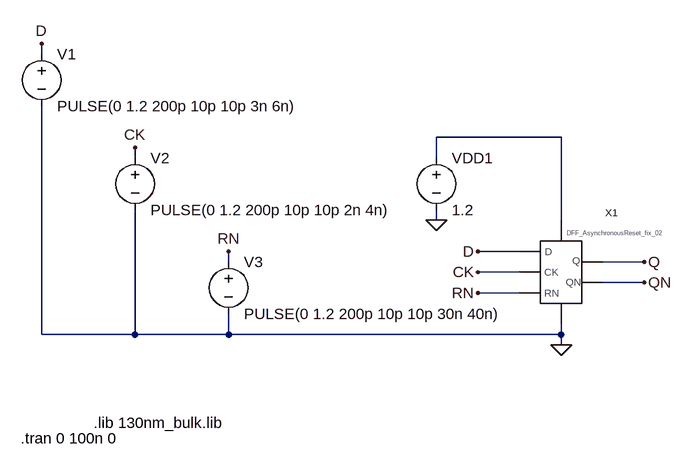
[diagram p0: schematic test_fix_02.asc]
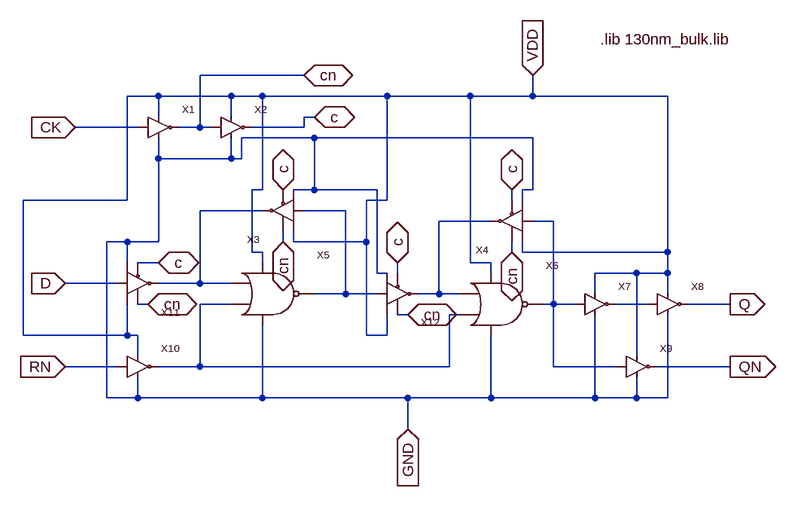
[diagram p1: sub-circuit ffd_rs_fix_02.asc]
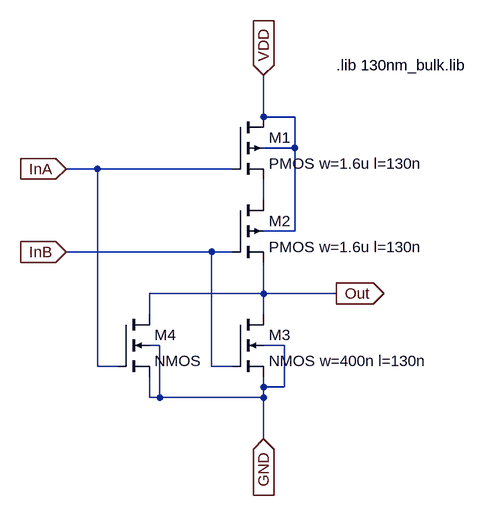
[diagram p2: sub-circuit nor.asc]
test_fix_02.asc, the LTspice schematic file:
Version 4
SHEET 1 880 680
WIRE -288 -240 -288 -256
WIRE 512 -112 320 -112
WIRE -144 -80 -144 -96
WIRE 320 -80 320 -112
WIRE 320 16 320 0
WIRE 512 16 512 -112
WIRE 448 64 384 64
WIRE 0 80 0 64
WIRE 640 80 576 80
WIRE 448 96 384 96
WIRE 640 112 576 112
WIRE 448 128 384 128
WIRE -288 192 -288 -160
WIRE -144 192 -144 0
WIRE -144 192 -288 192
WIRE 0 192 0 160
WIRE 0 192 -144 192
WIRE 512 192 512 176
WIRE 512 192 0 192
WIRE 512 208 512 192
FLAG 512 208 0
FLAG 320 16 0
FLAG -288 -256 D
FLAG 384 64 D
FLAG -144 -96 CK
FLAG 384 96 CK
FLAG 0 64 RN
FLAG 384 128 RN
FLAG 640 80 Q
FLAG 640 112 QN
SYMBOL voltage -288 -256 R0
WINDOW 123 0 0 Left 0
WINDOW 39 0 0 Left 0
SYMATTR InstName V1
SYMATTR Value PULSE(0 1.2 200p 10p 10p 3n 6n)
SYMBOL voltage -144 -96 R0
WINDOW 123 0 0 Left 0
WINDOW 39 0 0 Left 0
SYMATTR InstName V2
SYMATTR Value PULSE(0 1.2 200p 10p 10p 2n 4n)
SYMBOL voltage 0 64 R0
WINDOW 123 0 0 Left 0
WINDOW 39 0 0 Left 0
SYMATTR InstName V3
SYMATTR Value PULSE(0 1.2 200p 10p 10p 30n 40n)
SYMBOL voltage 320 -96 R0
SYMATTR InstName VDD1
SYMATTR Value 1.2
SYMBOL FFD_RS_fix_02 512 96 R0
SYMATTR InstName X1
TEXT -208 328 Left 2 !.lib 130nm_bulk.lib
TEXT -320 352 Left 2 !.tran 0 100n 0

ffd_rs_fix_02.asc, the sub-circuit schematic file:
Version 4
SHEET 1 880 680
WIRE 112 -80 -48 -80
WIRE -112 -48 -160 -48
WIRE 0 -48 -112 -48
WIRE 48 -48 0 -48
WIRE 240 -48 48 -48
WIRE 368 -48 240 -48
WIRE 464 -48 464 -80
WIRE 464 -48 368 -48
WIRE 672 -48 464 -48
WIRE -112 -16 -112 -48
WIRE 0 -16 0 -48
WIRE 128 -16 112 -16
WIRE -144 0 -240 0
WIRE -48 0 -48 -80
WIRE -48 0 -80 0
WIRE -32 0 -48 0
WIRE 112 0 112 -16
WIRE 112 0 32 0
WIRE 128 16 16 16
WIRE 464 16 128 16
WIRE -112 48 -112 16
WIRE 0 48 0 16
WIRE 0 48 -112 48
WIRE 16 48 16 16
WIRE 16 48 0 48
WIRE 48 96 48 -48
WIRE 48 96 32 96
WIRE 128 96 128 16
WIRE 128 96 96 96
WIRE 224 96 128 96
WIRE 464 96 464 16
WIRE 464 96 448 96
WIRE -160 112 -160 -48
WIRE -160 112 -320 112
WIRE 240 112 240 -48
WIRE 240 112 208 112
WIRE 432 112 432 96
WIRE 448 112 448 96
WIRE 48 128 -48 128
WIRE 176 128 112 128
WIRE 400 144 320 144
WIRE 496 144 464 144
WIRE -160 176 -192 176
WIRE -112 176 -112 48
WIRE -112 176 -160 176
WIRE 80 176 80 160
WIRE 96 176 96 160
WIRE 208 176 208 112
WIRE 208 176 96 176
WIRE 32 192 32 96
WIRE 48 192 32 192
WIRE 432 192 432 176
WIRE 448 192 448 176
WIRE 672 192 672 -48
WIRE 672 192 448 192
WIRE -160 208 -160 176
WIRE -112 208 -144 208
WIRE 48 208 48 192
WIRE 368 208 368 -48
WIRE 400 208 368 208
WIRE 224 224 224 96
WIRE 240 224 224 224
WIRE 256 224 256 208
WIRE 400 224 400 208
WIRE 624 224 560 224
WIRE 672 224 672 192
WIRE 672 224 624 224
WIRE -176 240 -256 240
WIRE -48 240 -48 128
WIRE -48 240 -112 240
WIRE 0 240 -48 240
WIRE 176 256 176 128
WIRE 176 256 128 256
WIRE 224 256 176 256
WIRE 320 256 320 144
WIRE 320 256 288 256
WIRE 352 256 320 256
WIRE 560 256 560 224
WIRE 672 256 672 224
WIRE -128 272 -144 272
WIRE 0 272 -48 272
WIRE 496 272 496 144
WIRE 496 272 480 272
WIRE 528 272 496 272
WIRE 640 272 592 272
WIRE 768 272 704 272
WIRE 272 288 256 288
WIRE 352 288 336 288
WIRE -320 320 -320 112
WIRE -160 320 -160 272
WIRE -160 320 -320 320
WIRE -144 320 -160 320
WIRE 208 320 208 176
WIRE 240 320 240 288
WIRE 240 320 208 320
WIRE -144 352 -144 320
WIRE 624 352 624 224
WIRE -176 368 -256 368
WIRE -48 368 -48 272
WIRE -48 368 -112 368
WIRE 336 368 336 288
WIRE 336 368 -48 368
WIRE 496 368 496 272
WIRE 592 368 496 368
WIRE 768 368 656 368
WIRE -192 416 -192 176
WIRE -144 416 -144 384
WIRE -144 416 -192 416
WIRE 48 416 48 304
WIRE 48 416 -144 416
WIRE 272 416 48 416
WIRE 400 416 400 320
WIRE 400 416 272 416
WIRE 560 416 560 288
WIRE 560 416 400 416
WIRE 624 416 624 384
WIRE 624 416 560 416
WIRE 672 416 672 288
WIRE 672 416 624 416
WIRE 272 464 272 416
FLAG -240 0 CK
IOPIN -240 0 In
FLAG 112 -80 cn
IOPIN 112 -80 BiDir
FLAG -256 368 RN
IOPIN -256 368 In
FLAG -256 240 D
IOPIN -256 240 In
FLAG 768 272 Q
IOPIN 768 272 Out
FLAG 768 368 QN
IOPIN 768 368 Out
FLAG 432 96 c
IOPIN 432 96 BiDir
FLAG -112 208 c
IOPIN -112 208 BiDir
FLAG -128 272 cn
IOPIN -128 272 BiDir
FLAG 432 192 cn
IOPIN 432 192 BiDir
FLAG 464 -80 VDD
IOPIN 464 -80 In
FLAG 272 464 GND
IOPIN 272 464 In
FLAG 128 -16 c
IOPIN 128 -16 BiDir
FLAG 80 96 c
IOPIN 80 96 BiDir
FLAG 256 208 c
IOPIN 256 208 BiDir
FLAG 80 176 cn
IOPIN 80 176 BiDir
FLAG 272 288 cn
IOPIN 272 288 BiDir
SYMBOL Inverter -80 16 R0
SYMATTR InstName X1
SYMBOL Inverter 32 16 R0
SYMATTR InstName X2
SYMBOL Tristate_Inv 16 96 R180
SYMATTR InstName X3
SYMBOL Tristate_Inv 368 112 R180
SYMATTR InstName X4
SYMBOL NOR 32 256 R0
SYMATTR InstName X5
SYMBOL NOR 384 272 R0
SYMATTR InstName X6
SYMBOL Inverter 592 288 R0
SYMATTR InstName X7
SYMBOL Inverter 704 288 R0
SYMATTR InstName X8
SYMBOL Inverter 656 384 R0
SYMATTR InstName X9
SYMBOL Inverter -112 384 R0
SYMATTR InstName X10
SYMBOL Tristate_Inv -80 208 M180
SYMATTR InstName X11
SYMBOL Tristate_Inv 320 224 M180
SYMATTR InstName X12
TEXT 568 -136 Left 2 !.lib 130nm_bulk.lib

nor.asc, the sub-circuit schematic file:
Version 4
SHEET 1 880 680
WIRE 240 16 240 -48
WIRE 288 16 240 16
WIRE 288 64 288 16
WIRE 288 64 240 64
WIRE -16 96 -64 96
WIRE 192 96 -16 96
WIRE 240 144 240 112
WIRE 288 192 288 64
WIRE 288 192 240 192
WIRE 160 224 -64 224
WIRE 192 224 160 224
WIRE 240 288 240 240
WIRE 240 288 64 288
WIRE 352 288 240 288
WIRE 64 320 64 288
WIRE 240 320 240 288
WIRE 80 368 64 368
WIRE 272 368 240 368
WIRE -16 400 -16 96
WIRE 16 400 -16 400
WIRE 160 400 160 224
WIRE 192 400 160 400
WIRE 240 432 240 416
WIRE 272 432 272 368
WIRE 272 432 240 432
WIRE 64 448 64 416
WIRE 80 448 80 368
WIRE 80 448 64 448
WIRE 240 448 240 432
WIRE 240 448 80 448
WIRE 240 512 240 448
FLAG -64 96 InA
IOPIN -64 96 In
FLAG -64 224 InB
IOPIN -64 224 In
FLAG 240 -48 VDD
IOPIN 240 -48 In
FLAG 240 512 GND
IOPIN 240 512 In
FLAG 352 288 Out
IOPIN 352 288 Out
SYMBOL pmos4 192 16 R0
SYMATTR InstName M1
SYMATTR Value2 l=130n w=1.6u
SYMATTR Value PMOS w=1.6u l=130n
SYMBOL pmos4 192 144 R0
SYMATTR InstName M2
SYMATTR Value2 l=130n w=1.6u
SYMATTR Value PMOS w=1.6u l=130n
SYMBOL nmos4 192 320 R0
SYMATTR InstName M3
SYMATTR Value2 l=130n w=400n
SYMATTR Value NMOS w=400n l=130n
SYMBOL nmos4 16 320 R0
SYMATTR InstName M4
SYMATTR Value2 l=130n w=400n
TEXT 352 -64 Left 2 !.lib 130nm_bulk.lib

The netlist it stands for:
* test_fix_02.asc
V1 D 0 PULSE(0 1.2 200p 10p 10p 3n 6n)
V2 CK 0 PULSE(0 1.2 200p 10p 10p 2n 4n)
V3 RN 0 PULSE(0 1.2 200p 10p 10p 30n 40n)
VDD1 N001 0 1.2
XX1 N001 0 D CK RN Q QN ffd_rs_fix_02

* block symbol definitions
.subckt ffd_rs_fix_02 VDD GND D CK RN Q QN
XX1 CK VDD GND cn Inverter  ; pins In VDD GND Out
XX2 cn VDD GND c Inverter  ; pins In VDD GND Out
XX3 N002 VDD GND cn c N001 Tristate_Inv  ; pins In VDD GND EN NEN Out
XX4 N004 VDD GND cn c N003 Tristate_Inv  ; pins In VDD GND EN NEN Out
XX5 N001 N005 VDD GND N002 nor
XX6 N003 N005 VDD GND N004 nor
XX7 N004 VDD GND N006 Inverter  ; pins In VDD GND Out
XX8 N006 VDD GND Q Inverter  ; pins In VDD GND Out
XX9 N004 VDD GND QN Inverter  ; pins In VDD GND Out
XX10 RN VDD GND N005 Inverter  ; pins In VDD GND Out
XX11 D VDD GND cn c N001 Tristate_Inv  ; pins In VDD GND EN NEN Out
XX12 N002 VDD GND cn c N003 Tristate_Inv  ; pins In VDD GND EN NEN Out
.lib 130nm_bulk.lib
.ends ffd_rs_fix_02

.subckt nor InA InB VDD GND Out
M1 VDD InA N001 VDD PMOS w=1.6u l=130n l=130n w=1.6u
M2 N001 InB Out VDD PMOS w=1.6u l=130n l=130n w=1.6u
M3 Out InB GND GND NMOS w=400n l=130n l=130n w=400n
M4 Out InA GND GND NMOS l=130n w=400n
.lib 130nm_bulk.lib
.ends nor

.model NMOS NMOS
.model PMOS PMOS
.lib standard.mos
.lib 130nm_bulk.lib
.tran 0 100n 0
.backanno
.end